# Altium project SWDP_proj.PrjPcb
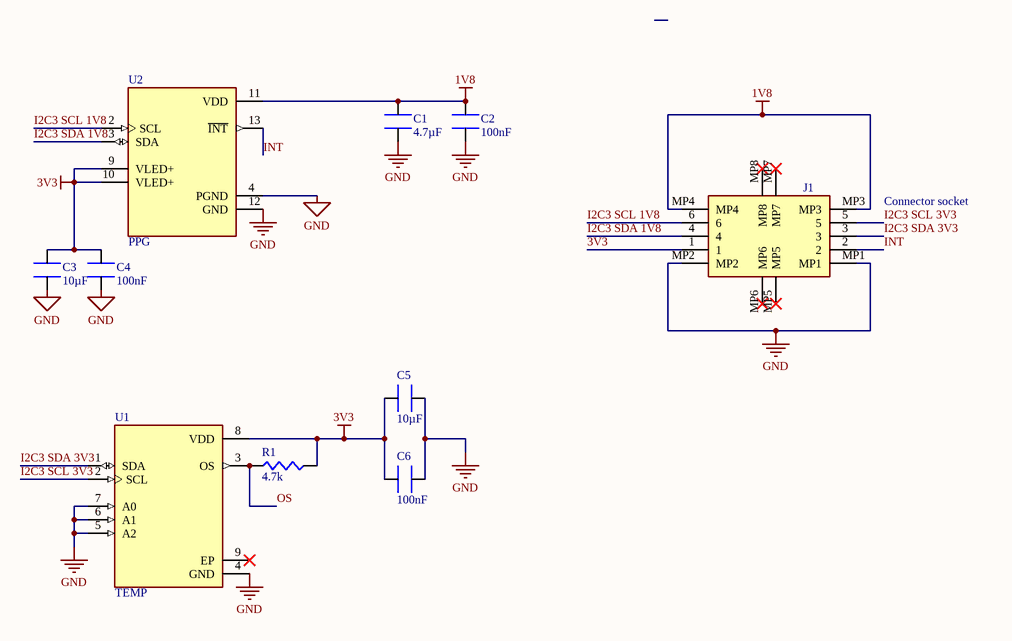
[diagram p0: Sheet1.SchDoc]
1 sheet, 10 parts. Net scope: global (net labels, ports and power ports of the same name join across sheets).
Board file: PCB1.PcbDoc

## Sheet Sheet1.SchDoc
size A4; SheetNumber: 1; SheetTotal: 1

### Parts
C1  value 4.7µF  [Chip2PinSM127P600-8N]  (hidden comment: 02016D475MAT2A)
C2  value 100nF  [Chip2PinSM127P600-8N]  (hidden comment: 0402YC104JAT4A)
C3  value 10µF  [Chip2PinSM127P600-8N]  (hidden comment: 0402ZD106MAT2A)
C4  value 100nF  [Chip2PinSM127P600-8N]  (hidden comment: 0402YC104JAT4A)
C5  value 10µF  [Chip2PinSM127P600-8N]  (hidden comment: 0402ZD106MAT2A)
C6  value 100nF  [Chip2PinSM127P600-8N]  (hidden comment: 0402YC104JAT4A)
J1  Connector socket  [BM29B066DS2035V53]
R1  value 4.7k  [Chip2PinSM127P600-8N]  (hidden comment: CR0201-JW-472GLF)
U1  TEMP  [SON65P300X300X80-9N]
U2  PPG  [PSON80P560X330X165-14N]

### Nets
1V8: C1.2 C2.2 J1.MP3 J1.MP4 U2.11(VDD)
3V3: C3.2 C4.2 C5.1 C6.1 J1.1 R1.2 U1.8(VDD) U2.9(VLED+) U2.10(VLED+)
GND: C1.1 C2.1 C3.1 C4.1 C5.2 C6.2 J1.MP1 J1.MP2 U1.4(GND) U1.5(A2) U1.6(A1) U1.7(A0) U2.4(PGND) U2.12(GND)
I2C3 SCL 1V8: J1.6 U2.2(SCL)
I2C3 SCL 3V3: J1.5 U1.2(SCL)
I2C3 SDA 1V8: J1.4 U2.3(SDA)
I2C3 SDA 3V3: J1.3 U1.1(SDA)
INT: J1.2 U2.13(~{INT})
OS: R1.1 U1.3(OS)

Not connected (* = marked no-connect by the designer): J1 MP5* MP6* MP7* MP8*; U1 9(EP)*

### Library data of the parts
C1 = CMP-001-00098-5: Condensatori in ceramica multistrato MLCC - SMD/SMT 6.3V 4.7uF X5R 0201 20%; Manufacturer: Kyocera AVX; Manufacturer Part Number: CM03X5R475M06AH055; Manufacturer Part Number: 02014D474MAT2A; RoHS Compliant: Yes; Tolerance: 20%; Min Operating Temperature: -55°C; Max Operating Temperature: 85°C; Mounting Technology: Surface Mount; Manufacturer: KYOCERA AVX; Manufacturer Part Number: 02016D475MAT2A; Component Type: Capacitors; ComponentLink1Description: New link; ComponentLink1URL: *; Supplier 1: Avnet; Supplier Part Number 1: 02016D475MAT2A
C2 C4 C6 = CMP-00047-1: Ceramic Capacitor, Multilayer, Ceramic, 16V, 5% +Tol, 5% -Tol, X7R, 15% TC, 0.1uF, Surface Mount, 0402; Manufacturer: KYOCERA AVX; Multilayer: Yes; Rated DC Voltage (URdc): 16V; Tolerance  (fill in as +-): 5%; Dielectric Material: Ceramic; Reach SVHC Compliant: Yes; Package Style: SMTMeter; Mounting Technology: Surface Mount; Length: 1mm; Termination: Wraparound; Min Operating Temperature: -55°C; Width: 0.5mm; Tolerance (fill in as +-): 5%; Case/Package: 0402; Capacitor Type: Ceramic; RoHS Compliant: Yes; JESD-609 Code: e3; Max Operating Temperature: 125°C; Height: 0.56mm; Pins: 2; Package Shape: Rectangular; Packaging: Tape and Reel; Temperature Characteristics Code: X7R; Terminal Finish: Nickel; Manufacturer Part Number: 0402YC104JAT4A; Component Type: Capacitors; Supplier 1: Avnet; Supplier Part Number 1: KGM05AR71C104JN
C3 C5 = CMP-00044-1: Ceramic Capacitor, Multilayer, Ceramic, 10V, 20% +Tol, 20% -Tol, X5R, 15% TC, 10uF, Surface Mount, 0402; Manufacturer: KYOCERA AVX; Multilayer: Yes; Rated DC Voltage (URdc): 10V; Packaging: Tape and Reel; Dielectric Material: Ceramic; Mounting Technology: Surface Mount; Tolerance (fill in as +-): 20%; Terminal Finish: Nickel; Termination: Wraparound; JESD-609 Code: e3; Pins: 2; Max Operating Temperature: 85°C; Temperature Characteristics Code: X5R; RoHS Compliant: Yes; Tolerance  (fill in as +-): 20%; Min Operating Temperature: -55°C; Reach SVHC Compliant: Yes; Capacitor Type: Ceramic; Package Shape: Rectangular; Case/Package: 0402; Manufacturer Part Number: 0402ZD106MAT2A; Component Type: Capacitors; Supplier 1: Future Electronics; Supplier Part Number 1: 3092588
J1 = BM29B0.6-6DS_2-0.35V_53_: FFC & FPC Connectors; Manufacturer_Name: Hirose; Manufacturer_Part_Number: BM29B0.6-6DS/2-0.35V(53); Geometry.Height: 0.7mm; Mouser Part Number: 798-29B066DS/2035V53; Mouser Price/Stock: https://www.mouser.co.uk/ProductDetail/Hirose-Connector/BM29B06-6DS-2-035V53?qs=vmHwEFxEFR%2FomrU63aDooQ%3D%3D; Datasheet Link: https://www.hirose.com/en/product/document?clcode=CL0673-7003-0-53&productname=BM29B0.6-6DS%2f2-0.35V(53)&series=BM29&documenttype=2DDrawing&lang=en&documentid=0001443321; Supplier 1: DigiKey; Supplier Part Number 1: 26-BM29B-6DP/2-0.35V(53)CT-ND
R1 = CMP-00117-1: Fixed Resistor, Metal Glaze/thick Film, 0.05W, 4700ohm, 30V, 5% +/-Tol, 200ppm/Cel, Surface Mount, 0201; Manufacturer: Bourns; Temperature Coefficient: 200ppm/°C; Working Voltage: 25V; Rated Temperature: 70°C; Package Height: 0.23mm; Power: 50mW; Package Width: 0.3mm; Package Length: 0.6mm; Max Operating Temperature: 125°C; Construction: Chip; Technology: RUTHENIUM OXIDE; Min Operating Temperature: -55°C; Terminal Finish: Nickel; Packaging: Tape and Reel; Pins: 2; Tolerance: 5%; Termination: Wraparound; Package Style: SMTMeter; Reach SVHC Compliant: Yes; Mounting Technology: Surface Mount; Package Shape: Rectangular; JESD-609 Code: e3; Case/Package: 0201; Resistor Type: FIXED RESISTOR; RoHS Compliant: Yes; Manufacturer Part Number: CR0201-JW-472GLF; Component Type: Resistors; Supplier 1: DigiKey; Supplier Part Number 1: 118-CR0201-JW-472GLFCT-ND
U1 = MAX30205MTA+T: Human Body Temperature Sensor; MF: Analog Devices; SnapEDA_Link: https://www.snapeda.com/parts/MAX30205MTA+T/Analog+Devices/view-part/?ref=snap; Package: TDFN-EP-8 Maxim; Value: *; MP: MAX30205MTA+T; Check_prices: https://www.snapeda.com/parts/MAX30205MTA+T/Analog+Devices/view-part/?ref=eda; Supplier 1: Farnell; Supplier Part Number 1: 3921729
U2 = MAX30101EFD+T: Pulse Oximeter and Heart Rate Sensor Digital Output 1.8V 14-Pin OLGA T/R; MF: Maxim Integrated Products; Purchase-URL: https://pricing.snapeda.com/search/part/MAX30101EFD+T/?ref=eda; SnapEDA_Link: https://www.snapeda.com/parts/MAX30101EFD+T/Maxim+Integrated/view-part/?ref=snap; MP: MAX30101EFD+T; Value: *; Check_prices: https://www.snapeda.com/parts/MAX30101EFD+T/Maxim+Integrated/view-part/?ref=eda; Digi-Key_Part_Number: MAX30101EFD+TTR-ND; Package: None; Supplier 1: Farnell; Supplier Part Number 1: 3596283